# Altium schematic sheet Audio.SchDoc
size A4; SheetNumber: 15; SheetTotal: 15
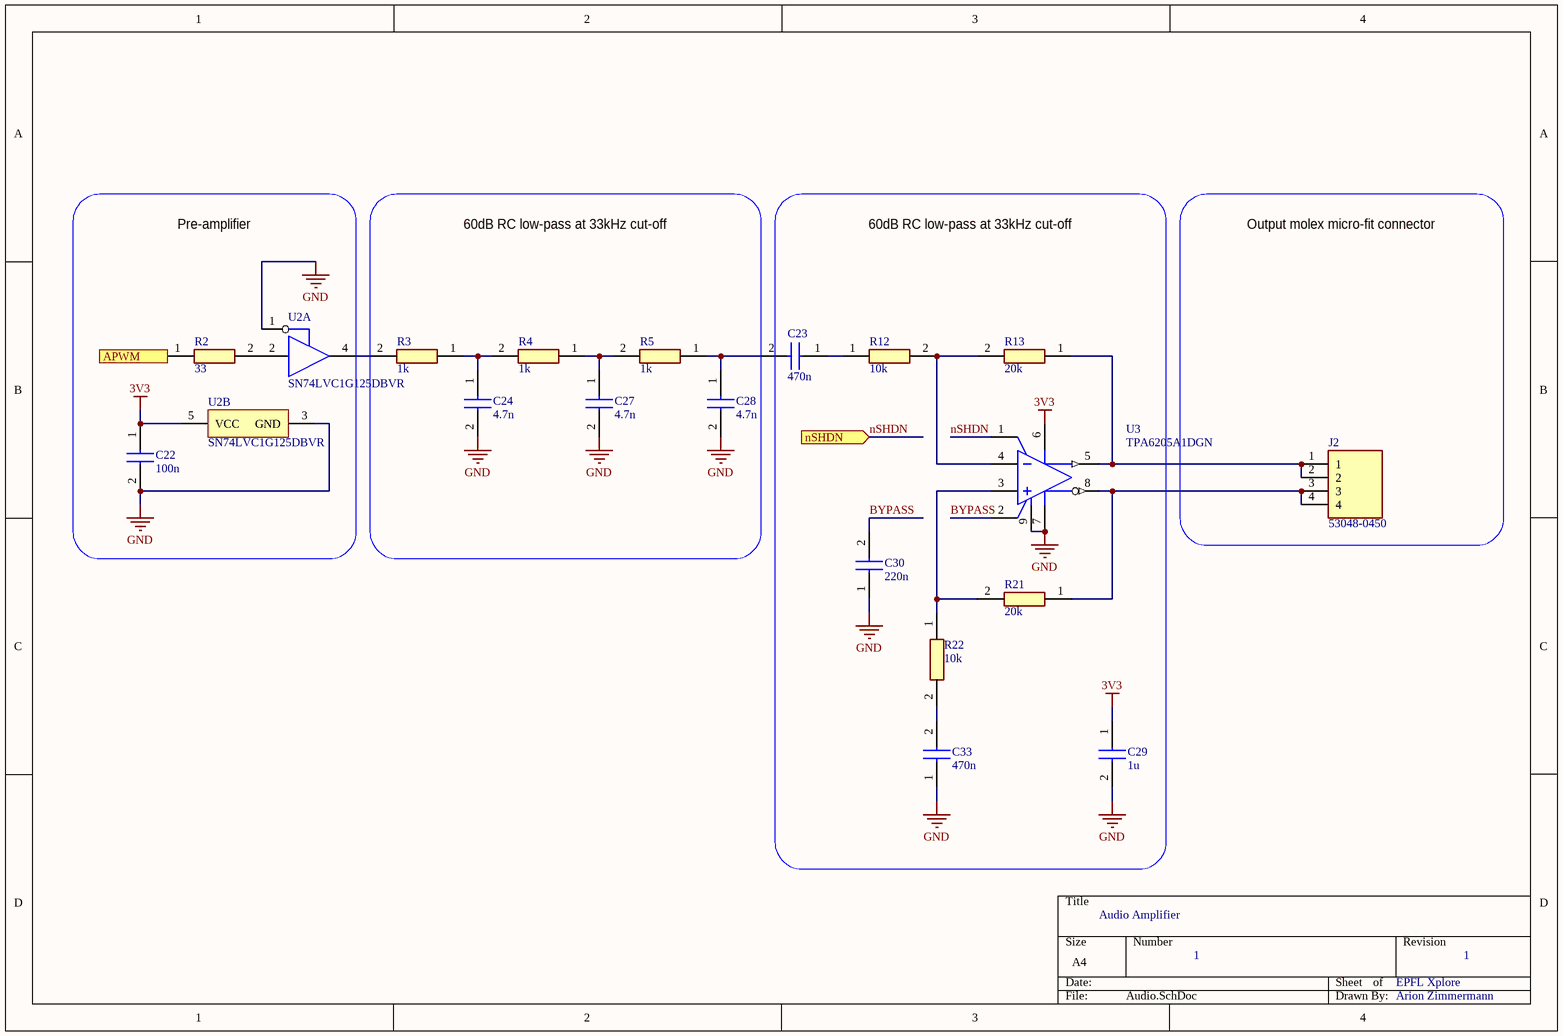
[diagram p0: Audio.SchDoc]

## Parts
C22  value 100n  [CAPC1608X95N]  (hidden comment: C0603C104K5RACTU)
C23  value 470n  [CAPC1608X95N]  (hidden comment: C0603C474K4PACTU)
C24  value 4.7n  [CAPC1608X95N]  (hidden comment: C0603C472J5RACTU)
C27  value 4.7n  [CAPC1608X95N]  (hidden comment: C0603C472J5RACTU)
C28  value 4.7n  [CAPC1608X95N]  (hidden comment: C0603C472J5RACTU)
C29  value 1u  [CAPC1608X95N]  (hidden comment: C0603C105K4RACTU)
C30  value 220n  [CAPC1608X95N]  (hidden comment: C0603C224K8RAC7411)
C33  value 470n  [CAPC1608X95N]  (hidden comment: C0603C474K4PACTU)
J2  53048-0450  [SHDRRA4W35P0X125_1X4_675X550X350P]
R2  value 33  [RESC1608X50N]  (hidden comment: CRCW060333R0JNEAC)
R3  value 1k  [RESC1608X50N]  (hidden comment: CRCW06031K00FKECC)
R4  value 1k  [RESC1608X50N]  (hidden comment: CRCW06031K00FKECC)
R5  value 1k  [RESC1608X50N]  (hidden comment: CRCW06031K00FKECC)
R12  value 10k  [RESC1608X50N]  (hidden comment: CRCW060310K2FKEA)
R13  value 20k  [RESC1608X50N]  (hidden comment: CRCW060320K0FKEAC)
R21  value 20k  [RESC1608X50N]  (hidden comment: CRCW060320K0FKEAC)
R22  value 10k  [RESC1608X50N]  (hidden comment: CRCW060310K2FKEA)
U2  SN74LVC1G125DBVR  [DBV0005A_M]  (parts A,B of 2)
U3  TPA6205A1DGN  [DGN0008D_N]

## Ports
APWM (in), nSHDN (in)

## Nets
3V3: C22.1 C29.1 U2.5(VCC) U3.6(VDD)
GND: C22.2 C24.2 C27.2 C28.2 C29.2 C30.1 C33.1 U2.1(~{OE}) U2.3(GND) U3.7(GND) U3.9(EP)
APWM: R2.1 ; port APWM
BYPASS: C30.2 U3.2(BYPASS)
nSHDN: U3.1(~{SHUTDOWN}) ; port nSHDN
NetC23_1: C23.1 R12.1
NetC23_2: C23.2 C28.1 R5.1
NetC24_1: C24.1 R3.1 R4.2
NetC27_1: C27.1 R4.1 R5.2
NetC33_2: C33.2 R22.2
NetJ2_1: J2.1 J2.2 R13.1 U3.5(VO+)
NetJ2_3: J2.3 J2.4 R21.1 U3.8(VO-)
NetR2_2: R2.2 U2.2(A)
NetR3_2: R3.2 U2.4(Y)
NetR12_2: R12.2 R13.2 U3.4(IN-)
NetR21_2: R21.2 R22.1 U3.3(IN+)

## Notes on the sheet
- Pre-amplifier
- 60dB RC low-pass at 33kHz cut-off
- Output molex micro-fit connector
- Audio Amplifier
- 1
- EPFL Xplore
- Arion Zimmermann

## Library data of the parts
C22-C24 C27-C30 C33 = C0603C104K5RACTU: Capacitor; Manufacturer_Name: Kemet; Datasheet Link: http://www.farnell.com/datasheets/2205446.pdf; Height: 0.95mm; Manufacturer_Part_Number: C0603C104K5RACTU; Mouser Part Number: 80-C0603C104K5R; Mouser Price/Stock: https://www.mouser.co.uk/ProductDetail/KEMET/C0603C104K5RACTU?qs=l5k%252BbMnNDkkVcnZPSAaaiQ%3D%3D; Arrow Part Number: C0603C104K5RACTU; Arrow Price/Stock: https://www.arrow.com/en/products/c0603c104k5ractu/kemet-corporation; Supplier 1: Mouser; Supplier Part Number 1: 80-C0603C104K5R
J2 = 53048-0450: Connector; Manufacturer_Name: Molex; Datasheet Link: https://www.molex.com/pdm_docs/sd/530480450_sd.pdf; Height: 3.5mm; Manufacturer_Part_Number: 53048-0450; Mouser Part Number: 538-53048-0450; Mouser Price/Stock: https://www.mouser.co.uk/ProductDetail/Molex/53048-0450?qs=0lSvoLzn4L%252Bhzo05ywM78Q%3D%3D
R2-R5 R12 R13 R21 R22 = CRCW0603931RFKEA: Resistor; Manufacturer_Name: Vishay; Manufacturer_Part_Number: CRCW0603787RFKEA; Datasheet Link: http://www.vishay.com/docs/20035/dcrcwe3.pdf; Height: 0.5mm; Supplier 1: Mouser; Supplier Part Number 1: 71-CRCW06032K00JNEB
U2 = CMP-0859-00019-3: Single Bus Buffer Gate With 3-State Outputs, DBV0005A, LARGE T&R; Manufacturer: Texas Instruments; VCC(Min)(V): 1.65; Sub-Family: Non-Inverting Buffer/Driver; tpd @ Nom Voltage(Max)(ns): 9,5.5,4.5,4; Input Type: CMOS/TTL; ICC @ Nom Voltage(Max)(mA): 0.01; Schmitt Trigger: No; Voltage(Nom)(V): 1.8,2.5,3.3,5; F @ Nom Voltage(Max)(Mhz): 150; Output Drive (IOL/IOH)(Max)(mA): 32/-32; 3-State Output: Yes; Output Type: CMOS; Bits(#): 1; Rating: Catalog; Technology Family: LVC; Logic: True; VCC(Max)(V): 5.5; PackageReference: DBV0005A; DatasheetVersion: SCES223T; Generic Part Number: SN74LVC1G125; Operating Temperature Range(C): -40 to 125,-40 to 85
U3 = CMP-0991-00073-2: 1.25-W Mono, Fully Differential, Class-AB Audio Amplifier with 1.8 V Compatible Shutdown Voltage, -40 to 85 degC, 8-pin SOP (DGN8), Green (RoHS & no Sb/Br); Manufacturer: Texas Instruments; PSRR(dB): -90; Output Power(W): 1.25; Supply Min(Min)(Volt): 2.5; SubFamily: Dynamic Speaker; Supply Max(Max)(Volt): 5.5; DatasheetVersion: SLOS490B; ComponentLink2Description: Datasheet; ComponentLink1Description: Manufacturer URL; ComponentLink3URL: http://www.ti.com/litv/pdf/mpds046e; Eco-Plan: Green (RoHS & no Sb/Br); Speaker Amp Type: Class-AB; Code_JEDEC: MO-187; ComponentLink1URL: http://www.ti.com/; PackageVersion: 4073271/F, 05/2011; Speaker Channels: Mono; PartNumber: TPA6205A1DGN; PackageDescription: 8-Pin Plastic Small Outline, Body 3 x 3 mm, Pitch 0.65 mm; Mounting Technology: Surface Mount; ComponentLink3Description: Package Specification; ComponentLink2URL: http://www.ti.com/general/docs/lit/getliterature.tsp?genericPartNumber=TPA6205A1&fileType=pdf; PackageReference: DGN0008D